# Altium project EXPANSION PUERTOS MEGA256.PrjPcb
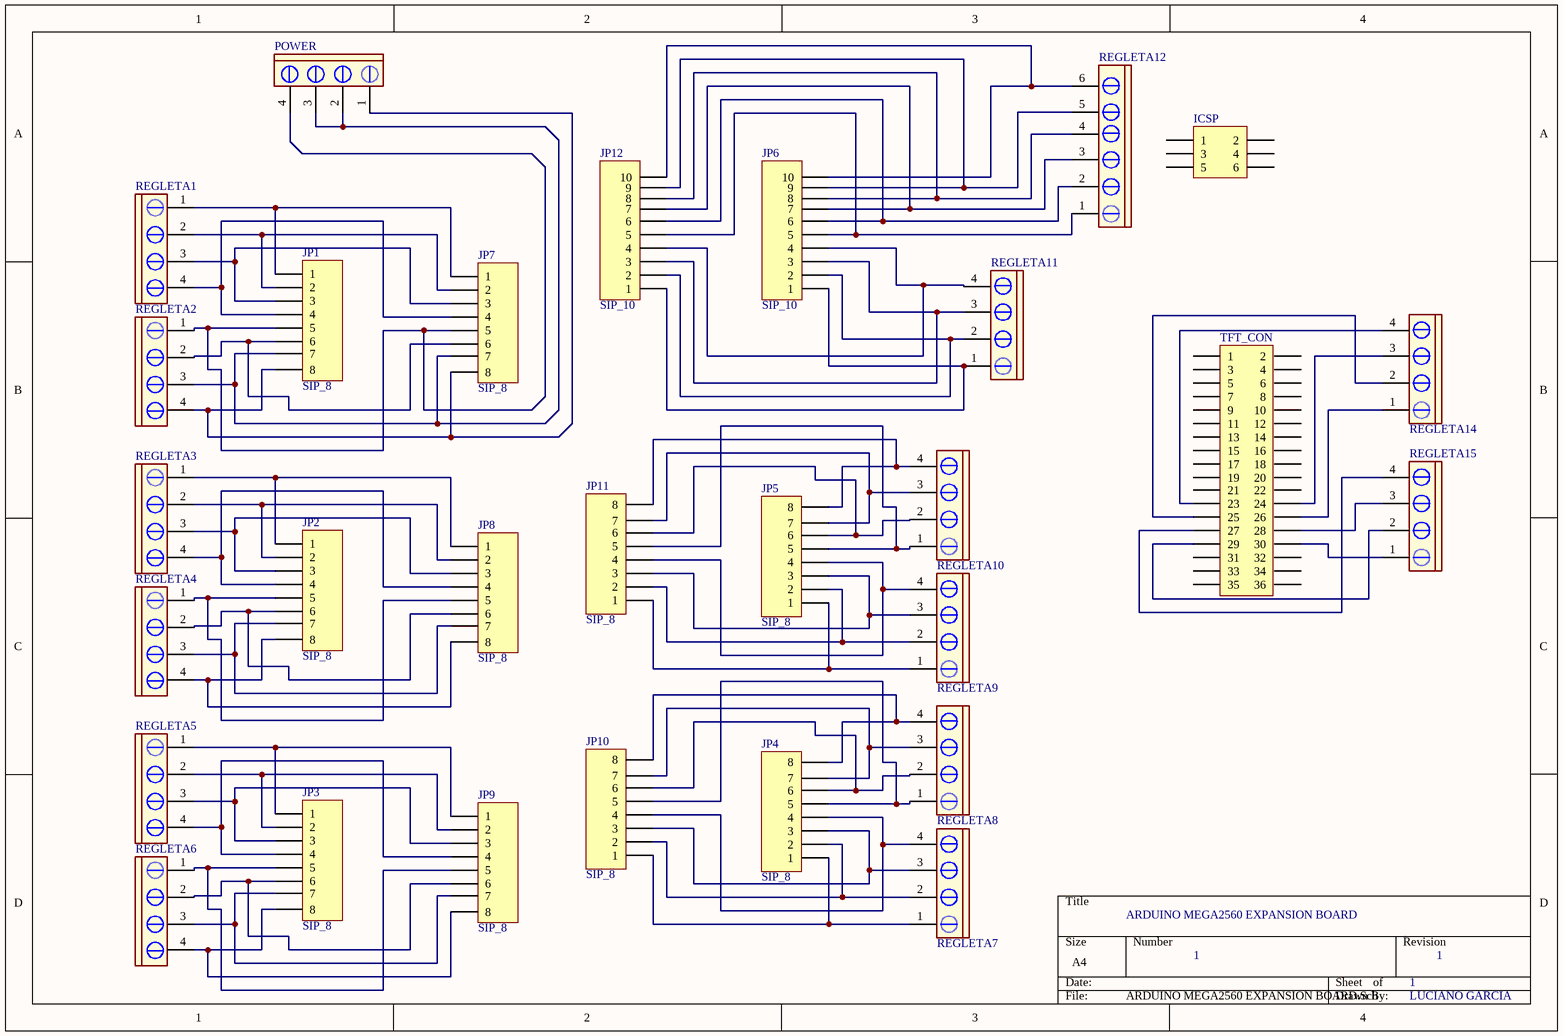
[diagram p0: ARDUINO MEGA2560 EXPANSION BOARD.SchDoc]
1 sheet, 29 parts. Net scope: global (net labels, ports and power ports of the same name join across sheets).
Board files: ARDUINO MEGA2560 EXPANSION BOARD_prueba.PcbDoc, ARDUINO MEGA2560 EXPANSION BOARD1.PcbDoc, ARDUINO MEGA2560 EXPANSION BOARD_solo tamaño placa.PcbDoc

## Sheet ARDUINO MEGA2560 EXPANSION BOARD.SchDoc
size A4

### Parts
ICSP  SIP_2X3  [SIP_2X03]  (value not drawn)
JP1  SIP_8  [SIP_8]
JP2  SIP_8  [SIP_8]
JP3  SIP_8  [SIP_8]
JP4  SIP_8  [SIP_8]
JP5  SIP_8  [SIP_8]
JP6  SIP_10  [SIP_10]
JP7  SIP_8  [SIP_8]
JP8  SIP_8  [SIP_8]
JP9  SIP_8  [SIP_8]
JP10  SIP_8  [SIP_8]
JP11  SIP_8  [SIP_8]
JP12  SIP_10  [SIP_10]
POWER  REGLETA_4  [REGLETA_4]  (value not drawn)
REGLETA1  REGLETA_4  [REGLETA_4]  (value not drawn)
REGLETA2  REGLETA_4  [REGLETA_4]  (value not drawn)
REGLETA3  REGLETA_4  [REGLETA_4]  (value not drawn)
REGLETA4  REGLETA_4  [REGLETA_4]  (value not drawn)
REGLETA5  REGLETA_4  [REGLETA_4]  (value not drawn)
REGLETA6  REGLETA_4  [REGLETA_4]  (value not drawn)
REGLETA7  REGLETA_4  [REGLETA_4]  (value not drawn)
REGLETA8  REGLETA_4  [REGLETA_4]  (value not drawn)
REGLETA9  REGLETA_4  [REGLETA_4]  (value not drawn)
REGLETA10  REGLETA_4  [REGLETA_4]  (value not drawn)
REGLETA11  REGLETA_4  [REGLETA_4]  (value not drawn)
REGLETA12  REGLETA_6  [REGLETA_6]  (value not drawn)
REGLETA14  REGLETA_4  [REGLETA_4]  (value not drawn)
REGLETA15  REGLETA_4  [REGLETA_4]  (value not drawn)
TFT_CON  SIP_2X18  [SIP_2X18]  (value not drawn)

### Nets
NetJP1_1: JP1.1 JP7.1 REGLETA1.1
NetJP1_2: JP1.2 JP7.2 REGLETA1.2
NetJP1_3: JP1.3 JP7.3 REGLETA1.3
NetJP1_4: JP1.4 JP7.4 REGLETA1.4
NetJP1_5: JP1.5 JP7.5 POWER.4 REGLETA2.1
NetJP1_6: JP1.6 JP7.6 REGLETA2.2
NetJP1_7: JP1.7 JP7.7 POWER.2 POWER.3 REGLETA2.3
NetJP1_8: JP1.8 JP7.8 POWER.1 REGLETA2.4
NetJP2_1: JP2.1 JP8.1 REGLETA3.1
NetJP2_2: JP2.2 JP8.2 REGLETA3.2
NetJP2_3: JP2.3 JP8.3 REGLETA3.3
NetJP2_4: JP2.4 JP8.4 REGLETA3.4
NetJP2_5: JP2.5 JP8.5 REGLETA4.1
NetJP2_6: JP2.6 JP8.6 REGLETA4.2
NetJP2_7: JP2.7 JP8.7 REGLETA4.3
NetJP2_8: JP2.8 JP8.8 REGLETA4.4
NetJP3_1: JP3.1 JP9.1 REGLETA5.1
NetJP3_2: JP3.2 JP9.2 REGLETA5.2
NetJP3_3: JP3.3 JP9.3 REGLETA5.3
NetJP3_4: JP3.4 JP9.4 REGLETA5.4
NetJP3_5: JP3.5 JP9.5 REGLETA6.1
NetJP3_6: JP3.6 JP9.6 REGLETA6.2
NetJP3_7: JP3.7 JP9.7 REGLETA6.3
NetJP3_8: JP3.8 JP9.8 REGLETA6.4
NetJP4_1: JP4.1 JP10.1 REGLETA7.1
NetJP4_2: JP4.2 JP10.2 REGLETA7.2
NetJP4_3: JP4.3 JP10.3 REGLETA7.3
NetJP4_4: JP4.4 JP10.4 REGLETA7.4
NetJP4_5: JP4.5 JP10.5 REGLETA8.1
NetJP4_6: JP4.6 JP10.6 REGLETA8.2
NetJP4_7: JP4.7 JP10.7 REGLETA8.3
NetJP4_8: JP4.8 JP10.8 REGLETA8.4
NetJP5_1: JP5.1 JP11.1 REGLETA9.1
NetJP5_2: JP5.2 JP11.2 REGLETA9.2
NetJP5_3: JP5.3 JP11.3 REGLETA9.3
NetJP5_4: JP5.4 JP11.4 REGLETA9.4
NetJP5_5: JP5.5 JP11.5 REGLETA10.1
NetJP5_6: JP5.6 JP11.6 REGLETA10.2
NetJP5_7: JP5.7 JP11.7 REGLETA10.3
NetJP5_8: JP5.8 JP11.8 REGLETA10.4
NetJP6_1: JP6.1 JP12.1 REGLETA11.1
NetJP6_2: JP6.2 JP12.2 REGLETA11.2
NetJP6_3: JP6.3 JP12.3 REGLETA11.3
NetJP6_4: JP6.4 JP12.4 REGLETA11.4
NetJP6_5: JP6.5 JP12.5 REGLETA12.1
NetJP6_6: JP6.6 JP12.6 REGLETA12.2
NetJP6_7: JP6.7 JP12.7 REGLETA12.3
NetJP6_8: JP6.8 JP12.8 REGLETA12.4
NetJP6_9: JP6.9 JP12.9 REGLETA12.5
NetJP6_10: JP6.10 JP12.10 REGLETA12.6
NetREGLETA14_1: REGLETA14.1 TFT_CON.26
NetREGLETA14_2: REGLETA14.2 TFT_CON.25
NetREGLETA14_3: REGLETA14.3 TFT_CON.24
NetREGLETA14_4: REGLETA14.4 TFT_CON.23
NetREGLETA15_1: REGLETA15.1 TFT_CON.30
NetREGLETA15_2: REGLETA15.2 TFT_CON.29
NetREGLETA15_3: REGLETA15.3 TFT_CON.28
NetREGLETA15_4: REGLETA15.4 TFT_CON.27

Not connected (* = marked no-connect by the designer): ICSP 1 2 3 4 5 6; TFT_CON 1 2 3 4 5 6 7 8 9 10 11 12 13 14 15 16 17 18 19 20 21 22 31 32 33 34 35 36

### Notes on the sheet
- ARDUINO MEGA2560 EXPANSION BOARD
- 1
- LUCIANO GARCIA